# EAGLE design Isolator2.0 (EAGLE 9.4.2)
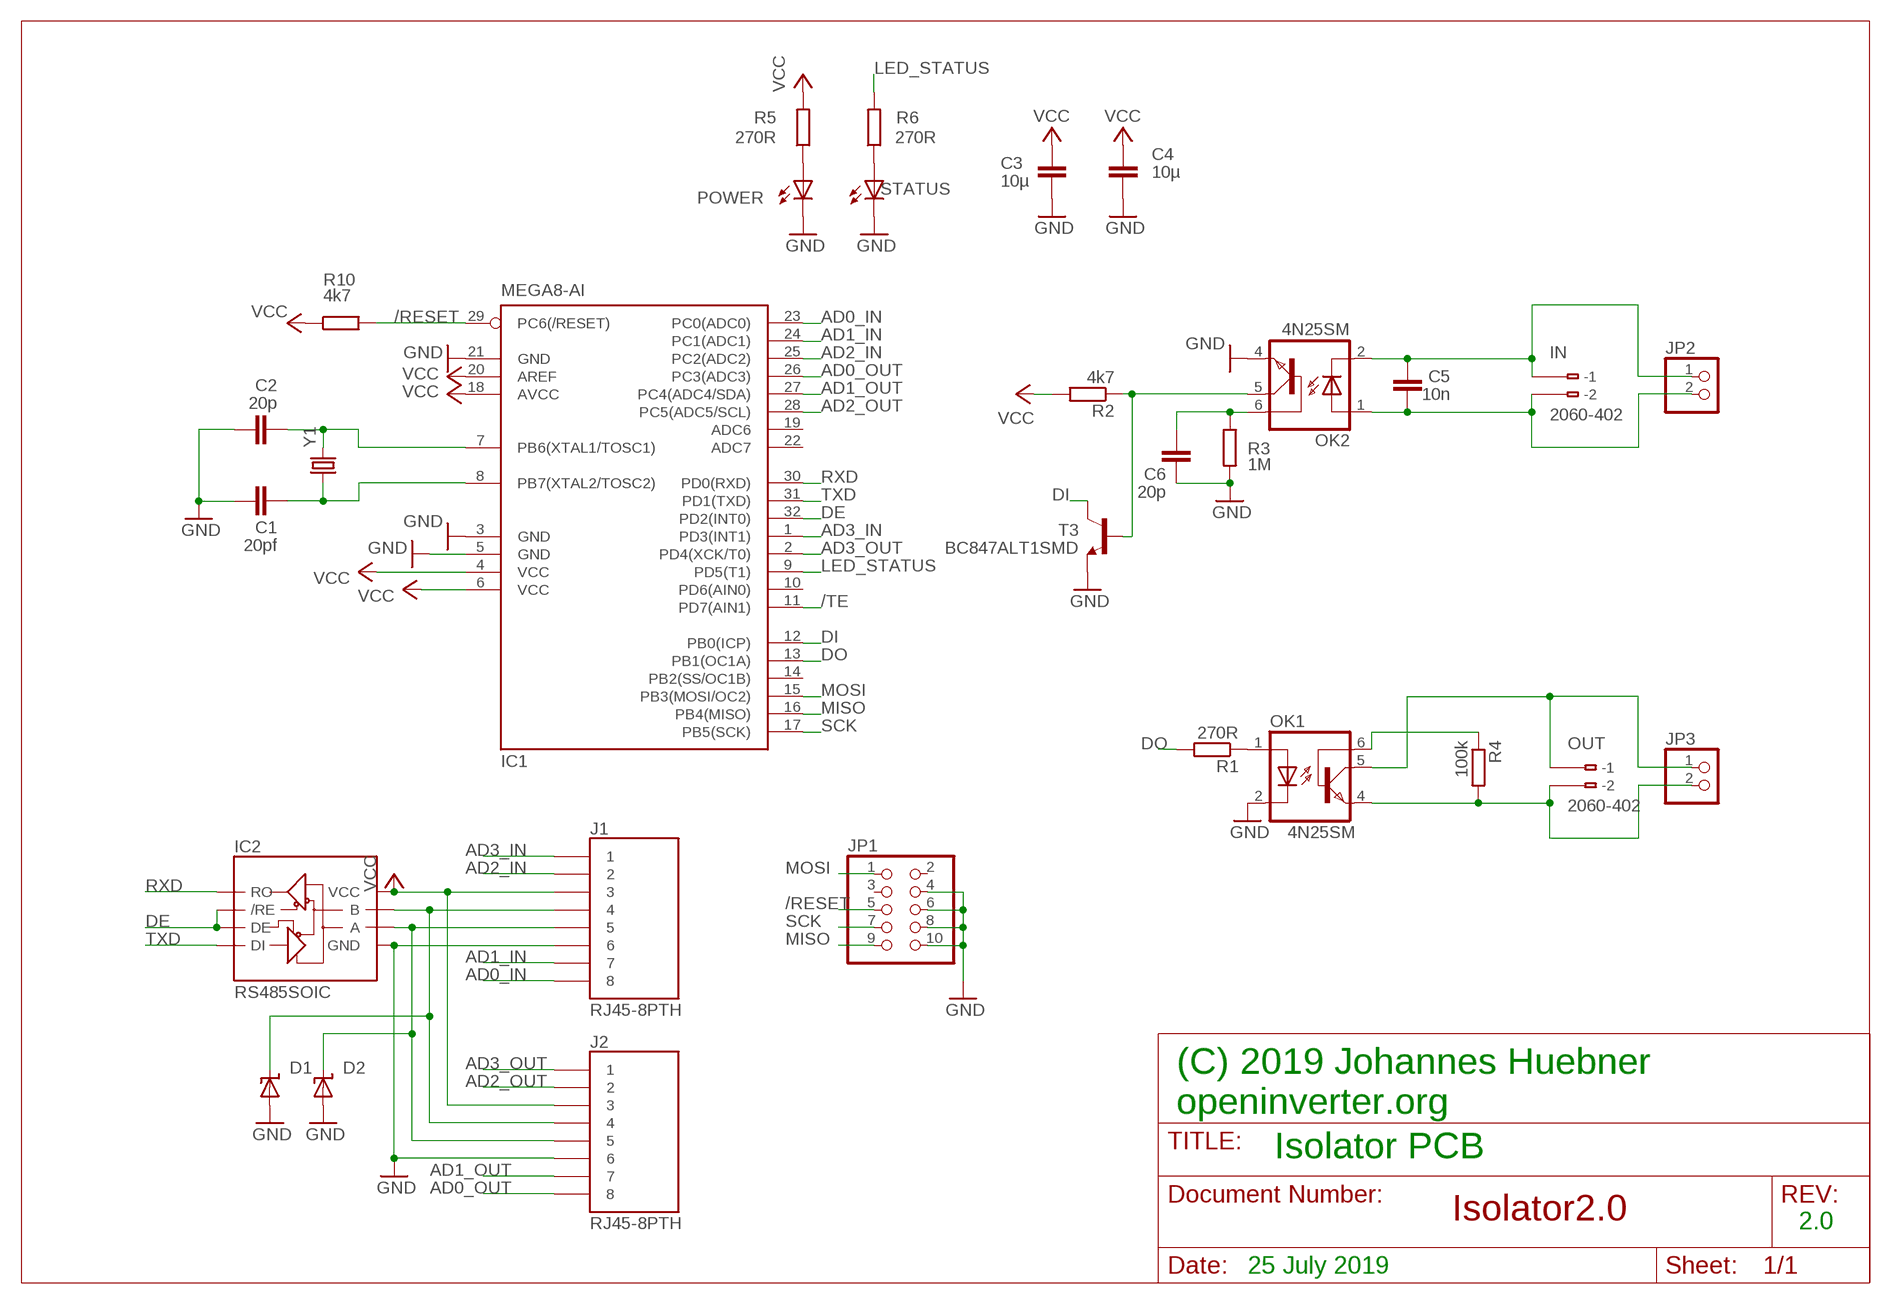
[diagram p0: schematic, sheet 1]

## Parts
C1  20pf  C-EUC0805  [C0805]
C2  20p  C-EUC0805  [C0805]
C3  10µ  C-EUC0805  [C0805]
C4  10µ  C-EUC0805  [C0805]
C5  10n  C-EUC0805  [C0805]
C6  20p  C-EUC0805  [C0805]
D1  SUPPRESSOR-SMBJ  [SMBJ]
D2  SUPPRESSOR-SMBJ  [SMBJ]
IC1  MEGA8-AI  [TQFP32-08]
IC2  RS485SOIC  [SO08]
IN  2060-402  [2060-402]
J1  RJ45-8PTH  [RJ45-8]
J2  RJ45-8PTH  [RJ45-8]
JP1  PINHD-2X5  [2X05]
JP2  PINHD-1X2  [1X02]
JP3  PINHD-1X2  [1X02]
OK1  4N25SM  [DIL6-SMD]
OK2  4N25SM  [DIL6-SMD]
OUT  2060-402  [2060-402]
POWER  LEDCHIP-LED0805  [CHIP-LED0805]
R1  270R  R-EU_M0805  [M0805]
R2  4k7  R-EU_M0805  [M0805]
R3  1M  R-EU_M0805  [M0805]
R4  100k  R-EU_M0805  [M0805]
R5  270R  R-EU_M0805  [M0805]
R6  270R  R-EU_M0805  [M0805]
R10  4k7  R-EU_M0805  [M0805]
STATUS  LEDCHIP-LED0805  [CHIP-LED0805]
T3  BC847ALT1SMD  [SOT23]
Y1  CRYSTAL10.5X4.8  [CRYSTAL-SMD-10.5X4.8-2PIN]

## Nets
/RESET: IC1.29(PC6(/RESET)) JP1.5 R10.2
/TE: IC1.11(PD7(AIN1))
AD0_IN: IC1.23(PC0(ADC0)) J1.8
AD0_OUT: IC1.26(PC3(ADC3)) J2.8
AD1_IN: IC1.24(PC1(ADC1)) J1.7
AD1_OUT: IC1.27(PC4(ADC4/SDA)) J2.7
AD2_IN: IC1.25(PC2(ADC2)) J1.2
AD2_OUT: IC1.28(PC5(ADC5/SCL)) J2.2
AD3_IN: IC1.1(PD3(INT1)) J1.1
AD3_OUT: IC1.2(PD4(XCK/T0)) J2.1
DE: IC1.32(PD2(INT0)) IC2.2(/RE) IC2.3(DE)
DI: IC1.12(PB0(ICP)) T3.3(C)
DO: IC1.13(PB1(OC1A)) R1.2
GND: C1.1 C2.1 C3.2 C4.2 C6.1 D1.A D2.A IC1.3(GND) IC1.5(GND) IC1.21(GND) IC2.5(GND) J1.6 J2.6 JP1.4 JP1.6 JP1.8 JP1.10 OK1.2(C) OK2.4(EMI) POWER.C R3.2 STATUS.C T3.2(E)
LED_STATUS: IC1.9(PD5(T1)) R6.2
MISO: IC1.16(PB4(MISO)) JP1.9
MOSI: IC1.15(PB3(MOSI/OC2)) JP1.1
N$1: OK1.1(A) R1.1
N$2: C6.2 OK2.6(BAS) R3.1
N$3: OK2.5(COL) R2.1 T3.1(B)
N$4: OK1.6(BAS) R4.1
N$5: D1.C IC2.7(B) J1.4 J2.4
N$6: JP3.2 OK1.4(EMI) OUT.P22(B-2) R4.2
N$7: D2.C IC2.6(A) J1.5 J2.5
N$8: POWER.A R5.1
N$9: R6.1 STATUS.A
N$10: C2.2 IC1.7(PB6(XTAL1/TOSC1)) Y1.P$2
N$11: C1.2 IC1.8(PB7(XTAL2/TOSC2)) Y1.P$1
N$12: C5.1 IN.P22(B-2) JP2.2 OK2.1(A)
N$13: C5.2 IN.P21(B-1) JP2.1 OK2.2(C)
N$14: JP3.1 OK1.5(COL) OUT.P21(B-1)
RXD: IC1.30(PD0(RXD)) IC2.1(RO)
SCK: IC1.17(PB5(SCK)) JP1.7
TXD: IC1.31(PD1(TXD)) IC2.4(DI)
VCC: C3.1 C4.1 IC1.4(VCC) IC1.6(VCC) IC1.18(AVCC) IC1.20(AREF) IC2.8(VCC) J1.3 J2.3 R2.2 R5.2 R10.1
Unconnected: IC1.10(PD6(AIN0)) IC1.14(PB2(SS/OC1B)) IC1.19(ADC6) IC1.22(ADC7) IN.P1.1(-1) IN.P1.2(-2) JP1.2 JP1.3 OUT.P1.1(-1) OUT.P1.2(-2)

## Notes on the sheet
- (C) 2019 Johannes Huebner
  openinverter.org
- Isolator PCB
- 2.0
- 25 July 2019

## Library data of the parts
C1-C6 = rcl:C-EU: CAPACITOR, European symbol
D1 D2 = diode:SUPPRESSOR-: Suppressor diode
IC1 = atmel:MEGA8: MICROCONTROLLER 8 Kbytes FLASH, 1 kbytes SRAM, 512 bytes EEPROM, USART, 6-channel 10 bit ADC, 2-channel 8 bit ADC Pin compatible with Atmega48, ATMega88, ATMega168 Source: avr.lbr; MPN: ATMEGA8-16AU; OC_FARNELL: 9171371; OC_NEWARK: 73M8863
IC2 = SparkFun-DigitalIC:RS485: RS485 transceiver
IN OUT = con-wago:2060-402
J1 J2 = SparkFun-Connectors:RJ45-8: RJ45 Jack Simple RJ45, 8-pin connection - connector for common Cat5, Cat5e, and Cat6 Ethernet cables. Footprint not yet proven in production. Connector sku is PRT-00643; Breakout PCB sku is BOB-00716.
JP1 = pinhead:PINHD-2X5: PIN HEADER
JP2 JP3 = pinhead:PINHD-1X2: PIN HEADER
OK1 OK2 = optocoupler:4N*?M: General Purpose 6-Pin Phototransistor Optocouplers Source: http://www.fairchildsemi.com/ds/4N/4N35-M.pdf; MF: FAIRCHILD SEMICONDUCTOR; MPN: 4N25SM; OC_FARNELL: 1021152; OC_NEWARK: 34C2020
POWER STATUS = led:LED: LED OSRAM: - CHIPLED LG R971, LG N971, LY N971, LG Q971, LY Q971, LO R971, LY R971 LH N974, LH R974 LS Q976, LO Q976, LY Q976 LO Q996 - Hyper CHIPLED LW Q18S LB Q993, LB Q99A, LB R99A - SideLED LS A670, LO A670, LY A670, LG A670, LP A670 LB A673, LV A673, LT A673, LW A673 LH A674 LY A675 LS A676, LA A676, LO A676, LY A676, LW A676 LS A679, LY A679, LG A679 - Hyper Micro SIDELED® LS Y876, LA Y876, LO Y876, LY Y876 LT Y87S - SmartLED LW L88C, LW L88S LB L89C, LB L89S, LG L890 LS L89K, LO L89K, LY L89K LS L896, LA L896, LO L896, LY L896 - TOPLED LS T670, LO T670, LY T670, LG T670, LP T670 LSG T670, LSP T670, LSY T670, LOP T670, LYG T670 LG T671, LOG T671, LSG T671 LB T673, LV T673, LT T673, LW T673 LH T674 LS T676, LA T676, LO T676, LY T676, LB T676, LH T676, LSB T676, LW T676 LB T67C, LV T67C, LT T67C, LS T67K, LO T67K, LY T67K, LW E67C LS E67B, LA E67B, LO E67B, LY E67B, LB E67C, LV E67C, LT E67C LW T67C LS T679, LY T679, LG T679 LS T770, LO T770, LY T770, LG T770, LP T770 LB T773, LV T773, LT T773, LW T773 LH T774 LS E675, LA E675, LY E675, LS T675 LS T776, LA T776, LO T776, LY T776, LB T776 LHGB T686 LT T68C, LB T68C - Hyper Mini TOPLED® LB M676 - Mini TOPLED Santana® LG M470 LS M47K, LO M47K, LY M47K Source: http://www.osram.convergy.de LUXEON: - LUMILED® LXK2-PW12-R00, LXK2-PW12-S00, LXK2-PW14-U00, LXK2-PW14-V00 LXK2-PM12-R00, LXK2-PM12-S00, LXK2-PM14-U00 LXK2-PE12-Q00, LXK2-PE12-R00, LXK2-PE12-S00, LXK2-PE14-T00, LXK2-PE14-U00 LXK2-PB12-K00, LXK2-PB12-L00, LXK2-PB12-M00, LXK2-PB14-N00, LXK2-PB14-P00, LXK2-PB14-Q00 LXK2-PR12-L00, LXK2-PR12-M00, LXK2-PR14-Q00, LXK2-PR14-R00 LXK2-PD12-Q00, LXK2-PD12-R00, LXK2-PD12-S00 LXK2-PH12-R00, LXK2-PH12-S00 LXK2-PL12-P00, LXK2-PL12-Q00, LXK2-PL12-R00 Source: www.luxeon.com KINGBRIGHT: KA-3528ASYC Source: www.kingbright.com
R1-R6 R10 = rcl:R-EU_: RESISTOR, European symbol
T3 = transistor-npn:BC847*: NPN Transistor
Y1 = SparkFun-FreqCtrl:CRYSTAL: Various standard crystals. Proven footprints. Spark Fun Electronics SKU : COM-00534

## Board
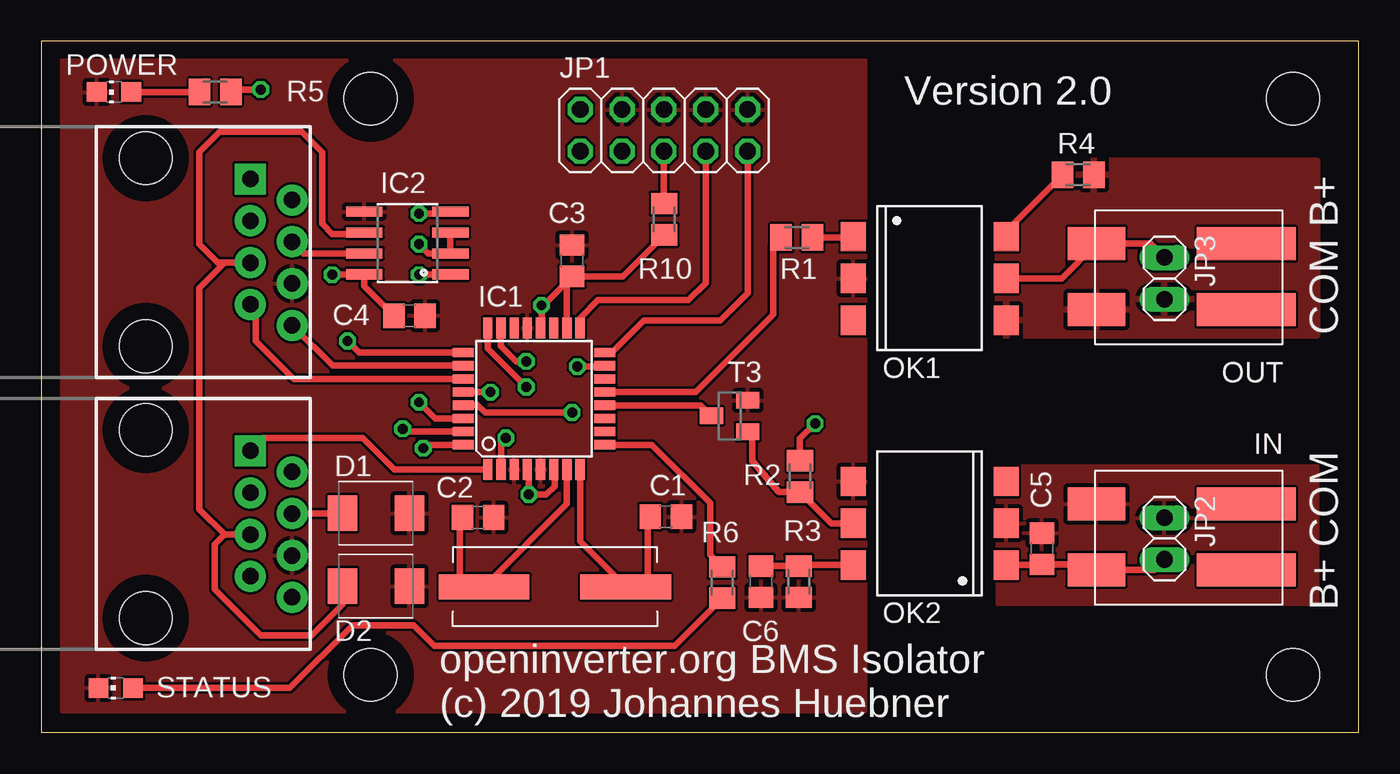
[diagram p1: board, top side]
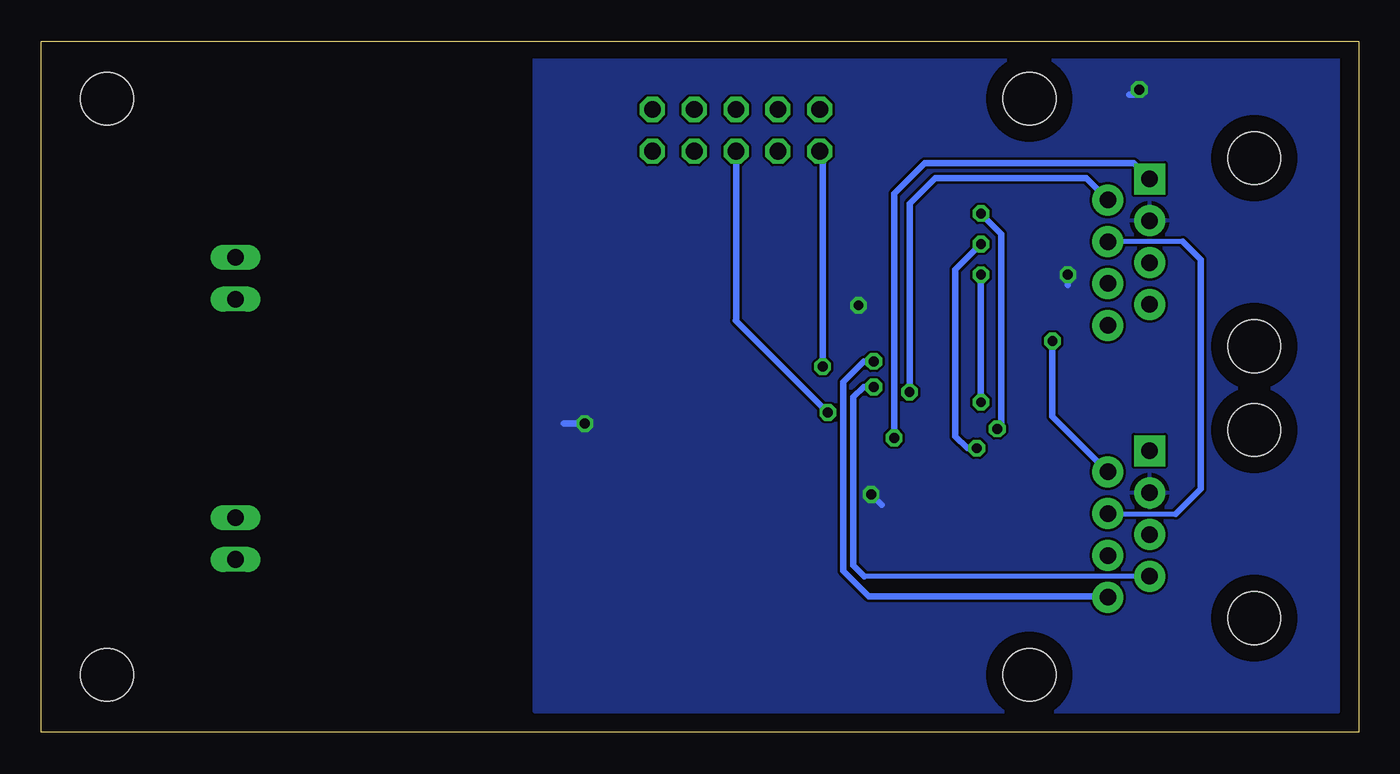
[diagram p2: board, bottom side, seen from below]

Size 80 x 42 mm. Coordinates in mm from the lower left corner, seen from the top.
Outline: 0,0 80,0 80,42 0,42 0,0
Copper layers (1*16): Top 0.035mm / dielectric 1.5mm / Bottom 0.035mm
Design rules "All PCB *": minimum track width 10mil, minimum drill 0.6mm, track to track 6mil, track to pad 6mil, pad to pad 6mil, via to via 6mil, smd to smd 6mil, copper to edge 40mil, drill to drill 8mil, minimum pad ring 10mil, minimum via ring 8mil, stop-mask expansion 4mil, vias tented up to drill 0mil, thermal gap 10mil
Holes 3.2 mm at 76,38.5 76,3.5 20,38.5 20,3.5

### Footprints (pad centres in the part's own frame; a part is rotated, then mirrored left to right if it is on the bottom)
C0805 = smd 1.3 x 1.5: 1 -0.95,0; 2 0.95,0
SMBJ = smd 1.78 x 2.16: A 2.04,0; C -2.03,0
TQFP32-08 = smd 1.27 x 0.559: 1 -4.293,2.8; 2 -4.293,2; 3 -4.293,1.2; 4 -4.293,0.4; 5 -4.293,-0.4; 6 -4.293,-1.2; 7 -4.293,-2; 8 -4.293,-2.8; 17 4.293,-2.8; 18 4.293,-2; 19 4.293,-1.2; 20 4.293,-0.4; 21 4.293,0.4; 22 4.293,1.2; 23 4.293,2; 24 4.293,2.8 | smd 0.559 x 1.27: 9 -2.8,-4.293; 10 -2,-4.293; 11 -1.2,-4.293; 12 -0.4,-4.293; 13 0.4,-4.293; 14 1.2,-4.293; 15 2,-4.293; 16 2.8,-4.293; 25 2.8,4.293; 26 2,4.293; 27 1.2,4.293; 28 0.4,4.293; 29 -0.4,4.293; 30 -1.2,4.293; 31 -2,4.293; 32 -2.8,4.293
SO08 = smd 0.61 x 2.21: 1 -1.905,-2.616; 2 -0.635,-2.616; 3 0.635,-2.616; 4 1.905,-2.616; 5 1.905,2.616; 6 0.635,2.616; 7 -0.635,2.616; 8 -1.905,2.616
2060-402 = smd 6 x 2: P1.1 -4.1,-2.1; P1.2 -4.1,1.9 | smd 3.5 x 2: P21 5,-2.1; P22 5,1.9
RJ45-8 = drill 1 pad 1.88 square: 1 -4.445,6.35 | drill 1 pad 1.88: 2 -3.175,8.89; 3 -1.905,6.35; 4 -0.635,8.89; 5 0.635,6.35; 6 1.905,8.89; 7 3.175,6.35; 8 4.445,8.89 | hole 3.2: -5.715,0; 5.715,0
2X05 = drill 1.016 octagon: 1 -5.08,-1.27; 2 -5.08,1.27; 3 -2.54,-1.27; 4 -2.54,1.27; 5 0,-1.27; 6 0,1.27; 7 2.54,-1.27; 8 2.54,1.27; 9 5.08,-1.27; 10 5.08,1.27
1X02 = drill 1.016 long: 1 -1.27,0; 2 1.27,0
DIL6-SMD = smd 1.78 x 1.52: 1 -2.54,-4.645; 2 0,-4.645; 3 2.54,-4.645; 4 2.54,4.645; 5 0,4.645; 6 -2.54,4.645
CHIP-LED0805 = smd 1.2 x 1.2: A 0,-1.05; C 0,1.05
M0805 = smd 1.3 x 1.6: 1 -0.95,0; 2 0.95,0
SOT23 = smd 1 x 1.4: 1 -0.95,-1.1; 2 0.95,-1.1; 3 0,1.1
CRYSTAL-SMD-10.5X4.8-2PIN = smd 5.5 x 1.5: P$1 -4.3,0; P$2 4.3,0

### Placement (x,y rotation side)
C1  37.93,13.11 180 top
C2  26.53,13.07 180 top
C3  32.23,28.66 90 top
C4  22.36,25.32 0 top
C5  60.76,11.16 90 top
C6  43.71,9.16 90 top
D1  20.32,13.32 0 top
D2  20.32,8.89 0 top
IC1  29.92,20.28 90 top
IC2  22.23,29.74 90 top
IN  69.07,11.78 180 top
J1  6.35,12.66 270 top
J2  6.35,29.18 270 top
JP1  37.81,36.58 0 top
JP2  68.2,11.78 270 top
JP3  68.2,27.59 270 top
OK1  53.94,27.59 270 top
OK2  53.94,12.71 90 top
OUT  69.07,27.59 180 top
POWER  4.42,38.91 90 top
R1  45.88,30.07 180 top
R2  46.07,15.56 90 top
R3  46,9.16 270 top
R4  62.96,33.88 0 top
R5  10.57,38.91 0 top
R6  41.35,9.11 90 top
R10  37.83,31.18 90 top
STATUS  4.53,2.7 90 top
T3  41.8,19.23 90 top
Y1  31.19,8.85 180 top

### Tracks (layer width: path | path; a pad name or v marks a point on that pad's centre or on a via)
/RESET  (via drill 0.6)
  Top 0.406: IC1.29 25.56,19.88 26.46,19.88 26.97,19.44 v32.24,19.44 | R10.2 37.81,32.15 JP1.5
  Bottom 0.406: v32.24,19.44 37.82,25.02 37.81,25.03 JP1.5
AD0_IN  (via drill 0.6)
  Top 0.406: v29.45,22.54 28.83,22.54 27.9,23.47 27.9,24.55 IC1.23
  Bottom 0.406: J1.8 15.3,8.28 29.76,8.28 31.31,9.83 31.31,21.3 30.07,22.54 v29.45,22.54
AD0_OUT
  Top 0.406: J2.8 17.7,22.28 IC1.26
AD1_IN  (via drill 0.6)
  Top 0.406: v29.45,20.99 27.12,23.32 IC1.24
  Bottom 0.305: J1.7 30.04,9.48
  Bottom 0.406: 30.04,9.48 30.69,10.14 30.69,20.37 30.07,20.99 v29.45,20.99
AD1_OUT
  Top 0.406: J2.7 13.02,25.68 13.02,23.78 15.32,21.48 IC1.27
AD2_IN  (via drill 0.6)
  Top 0.406: v18.6,23.78 19.3,23.08 IC1.25
  Bottom 0.406: J1.2 18.6,19.2 v18.6,23.78
AD2_OUT  (via drill 0.6)
  Top 0.406: v27.28,20.68 IC1.28
  Bottom 0.406: J2.2 16.55,33.67 25.73,33.67 27.28,32.12 v27.28,20.68
AD3_IN
  Top 0.406: J1.1 13.48,17.89 19.53,17.89 21.43,15.99 IC1.1
AD3_OUT  (via drill 0.6)
  Top 0.406: v28.21,17.89 27.92,17.56 IC1.2
  Bottom 0.406: J2.1 13.68,34.6 26.35,34.6 28.21,32.74 v28.21,17.89
DE  (via drill 0.6)
  Top 0.406: IC2.3 IC2.2 23.5,29.11 v22.94,29.67 | v23.2,17.27 23.41,17.48 IC1.32
  Bottom 0.406: v22.94,29.67 24.49,28.12 24.49,17.98 23.78,17.27 v23.2,17.27
DI
  Top 0.406: IC1.12 40.05,19.88 T3.3
DO
  Top 0.406: IC1.13 39.73,20.68 44.45,25.4 44.45,29.59 R1.2
GND
  pour Top: 1.27,41.27 50.02,41.27 50.02,1.27 1.27,1.27
LED_STATUS
  Top 0.406: R6.2 40.61,10.8 40.61,13.95 37.08,17.48 IC1.9
MISO
  Top 0.406: IC1.16 34.64,23.08 36.58,25.02 41.22,25.02 42.89,26.69 JP1.9
MOSI  (via drill 0.6)
  Top 0.406: IC1.15 34.16,22.23 v32.55,22.23
  Bottom 0.406: v32.55,22.23 32.55,35.25 32.61,35.31 JP1.1
N$1
  Top 0.406: R1.1 49.23,30.07 OK1.1
N$2
  Top 0.406: OK2.6 46.25,10.17 R3.1 C6.2
N$3
  Top 0.406: T3.1 43.18,18 43.18,16.51 44.77,14.61 R2.1 47.97,12.71 OK2.5
N$4
  Top 0.406: R4.1 58.59,30.45 OK1.6
N$5
  Top 0.406: J2.4 15.95,29.11 IC2.7 | D1.C 15.27,13.32 J1.4
  Bottom 0.305: 15.18,13.29 11.12,13.29 | 10.69,29.82 J2.4
  Bottom 0.406: J1.4 15.18,13.29 | 11.12,13.29 9.61,14.79 9.61,28.74 10.69,29.82
N$6
  pour Top: 58.08,24.13 77.47,24.13 77.47,34.75 58.08,34.75
N$7
  Top 0.305: D2.C 18.29,7.75
  Top 0.406: IC2.6 19.53,30.29 17.67,30.29 17.05,30.91 17.05,35.25 15.81,36.49 10.85,36.49 9.61,35.25 9.61,29.67 10.73,28.55 J2.5 11.15,28.55 9.61,27 9.61,13.55 11.13,12.03 | 11.13,12.03 J1.5 | 18.29,7.75 16.43,5.89 13.33,5.89 10.54,8.68 10.54,11.43 11.13,12.03
N$8
  Top 0.406: POWER.A R5.1
N$9
  Top 0.406: R6.1 38.46,5.27 23.87,5.27 22.63,6.51 18.91,6.51 15.1,2.7 STATUS.A
N$10
  Top 0.406: IC1.7 31.92,13.88 Y1.P$2 25.44,8.85 25.4,8.89 25.4,12.83 C2.2
N$11
  Top 0.406: IC1.8 32.72,11.62 Y1.P$1 36.79,8.85 36.83,8.89 36.83,12.96 C1.2
N$12
  Top 0.406: JP2.2 67.57,9.88 IN.P22 63.16,10.17 63.16,10.21 C5.1 60.76,10.17 OK2.1
N$13
  pour Top: 58.08,16.2 77.47,16.2 77.47,7.78 58.08,7.78
N$14
  Top 0.406: JP3.1 67.37,29.69 OUT.P21 61.97,27.59 OK1.5
RXD  (via drill 0.6)
  Top 0.406: IC2.1 24.82,27.81 v22.94,27.81 | v22.94,20.06 23.92,19.08 IC1.30
  Bottom 0.406: v22.94,27.81 v22.94,20.06
SCK
  Top 0.406: IC1.17 32.72,25.19 33.79,26.26 39.3,26.26 40.35,27.31 JP1.7
TXD  (via drill 0.6)
  Top 0.406: IC2.4 24.73,31.53 v22.94,31.53 | v21.95,18.45 22.11,18.28 IC1.31
  Bottom 0.406: v22.94,31.53 21.7,30.29 21.7,18.51 22.07,18.45 v21.95,18.45
VCC  (via drill 0.6)
  Top 0.406: C3.1 31.92,27.71 IC1.18 | IC1.4 29.61,15.9 v29.61,14.46 30.67,14.46 31.18,14.95 31.18,16.03 IC1.6 | C4.1 19.61,27.12 IC2.8 19.59,27.81 v17.67,27.81 | IC1.20 30.38,24.63 v30.38,25.95 30.47,25.95 C3.1 | R5.2 11.67,39.06 v13.33,39.06 | R10.1 35.31,27.71 C3.1 | R2.2 46.07,17.85 v46.99,18.77
  Bottom 0.406: v29.61,14.46 28.98,13.83 | v30.38,25.95 30.38,26.26 | v17.67,27.81 17.67,27.19 | v13.33,39.06 13.64,38.75 13.95,38.75 | v46.99,18.77 48.26,18.77
  pour Bottom: 1.27,1.27 50.02,1.27 50.02,41.27 1.27,41.27

### Text on the board
tNames: Version 2.0 | COM B+ | B+ COM | openinverter.org BMS Isolator / (c) 2019 Johannes Huebner